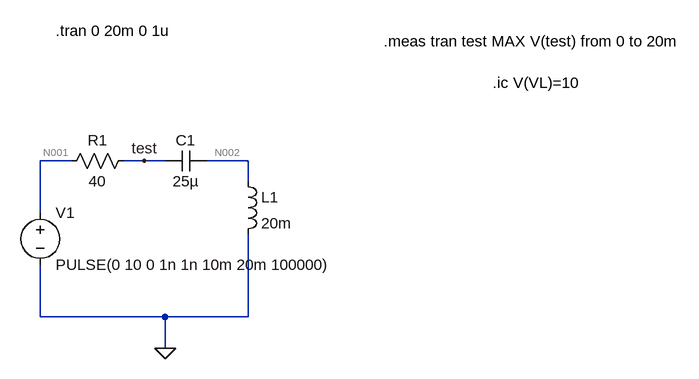
[diagram p0: schematic Question 5.asc]
Question 5.asc, the LTspice schematic file:
Version 4
SHEET 1 1072 680
WIRE 96 240 48 240
WIRE 208 240 176 240
WIRE 240 240 208 240
WIRE 368 240 304 240
WIRE 368 272 368 240
WIRE 48 320 48 240
WIRE 48 480 48 400
WIRE 240 480 48 480
WIRE 368 480 368 352
WIRE 368 480 240 480
WIRE 240 528 240 480
FLAG 240 528 0
FLAG 208 240 test
SYMBOL voltage 48 304 R0
WINDOW 123 0 0 Left 0
WINDOW 39 0 0 Left 0
SYMATTR InstName V1
SYMATTR Value PULSE(0 10 0 1n 1n 10m 20m 100000)
SYMBOL res 192 224 R90
WINDOW 0 0 56 VBottom 2
WINDOW 3 32 56 VTop 2
SYMATTR InstName R1
SYMATTR Value 40
SYMBOL cap 304 224 R90
WINDOW 0 0 32 VBottom 2
WINDOW 3 32 32 VTop 2
SYMATTR InstName C1
SYMATTR Value 25µ
SYMBOL ind 352 256 R0
SYMATTR InstName L1
SYMATTR Value 20m
TEXT 72 40 Left 2 !.tran 0 20m 0 1u
TEXT 576 56 Left 2 !.meas tran test MAX V(test) from 0 to 20m
TEXT 744 120 Left 2 !.ic V(VL)=10

The netlist it stands for:
* Question 5.asc
V1 N001 0 PULSE(0 10 0 1n 1n 10m 20m 100000)
R1 test N001 40
C1 N002 test 25µ
L1 N002 0 20m
.tran 0 20m 0 1u
.meas tran test MAX V(test) from 0 to 20m
.ic V(VL)=10
.backanno
.end

* Results of the author's LTspice run, read from the files saved beside the schematic
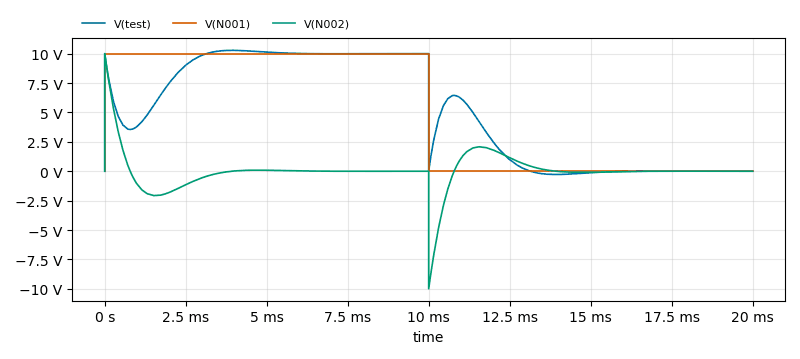
[diagram p1: Transient Analysis of Question 5.asc, plotted from the saved traces]
* Transient Analysis, 1 run:
*   V(test): min -278.4 mV, max 10.28 V, average 5 V, rms 6.71 V, last -493.7 µV
*   V(N001): min 0 V, max 10 V, average 5 V, rms 7.071 V, last 0 V
*   V(N002): min -10 V, max 10 V, average 49.53 µV, rms 1.596 V, last 134.1 µV
* From the log:
*   test: MAX(v(test))=10.2786 FROM 0 TO 0.02